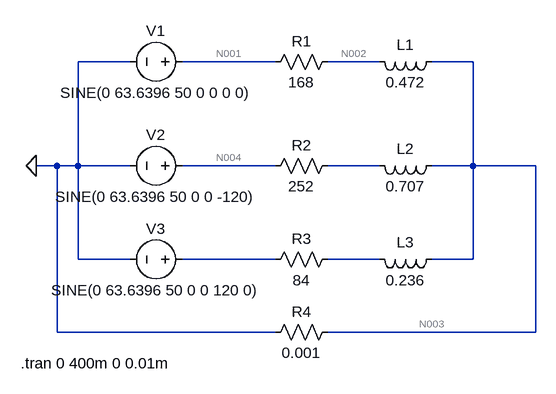
[diagram p0: schematic scheme3.asc]
scheme3.asc, the LTspice schematic file:
Version 4
SHEET 1 880 680
WIRE 128 112 48 112
WIRE 352 112 208 112
WIRE 512 112 432 112
WIRE 656 112 592 112
WIRE 16 272 -16 272
WIRE 48 272 48 112
WIRE 48 272 16 272
WIRE 128 272 48 272
WIRE 352 272 208 272
WIRE 512 272 432 272
WIRE 656 272 656 112
WIRE 656 272 592 272
WIRE 752 272 656 272
WIRE 48 416 48 272
WIRE 128 416 48 416
WIRE 352 416 208 416
WIRE 512 416 432 416
WIRE 656 416 656 272
WIRE 656 416 592 416
WIRE 16 528 16 272
WIRE 352 528 16 528
WIRE 752 528 752 272
WIRE 752 528 432 528
FLAG -16 272 0
SYMBOL voltage 224 112 R90
WINDOW 0 -32 56 VBottom 2
WINDOW 3 32 56 VTop 2
WINDOW 123 0 0 Left 0
WINDOW 39 0 0 Left 0
SYMATTR InstName V1
SYMATTR Value SINE(0 63.6396 50 0 0 0 0)
SYMBOL voltage 224 272 R90
WINDOW 0 -32 56 VBottom 2
WINDOW 3 32 56 VTop 2
WINDOW 123 0 0 Left 0
WINDOW 39 0 0 Left 0
SYMATTR InstName V2
SYMATTR Value SINE(0 63.6396 50 0 0 -120)
SYMBOL voltage 224 416 R90
WINDOW 0 -32 56 VBottom 2
WINDOW 3 32 56 VTop 2
WINDOW 123 0 0 Left 0
WINDOW 39 0 0 Left 0
SYMATTR InstName V3
SYMATTR Value SINE(0 63.6396 50 0 0 120 0)
SYMBOL res 448 96 R90
WINDOW 0 0 56 VBottom 2
WINDOW 3 32 56 VTop 2
SYMATTR InstName R1
SYMATTR Value 168
SYMBOL res 448 256 R90
WINDOW 0 0 56 VBottom 2
WINDOW 3 32 56 VTop 2
SYMATTR InstName R2
SYMATTR Value 252
SYMBOL res 448 400 R90
WINDOW 0 0 56 VBottom 2
WINDOW 3 32 56 VTop 2
SYMATTR InstName R3
SYMATTR Value 84
SYMBOL ind 608 96 R90
WINDOW 0 5 56 VBottom 2
WINDOW 3 32 56 VTop 2
SYMATTR InstName L1
SYMATTR Value 0.472
SYMBOL ind 608 256 R90
WINDOW 0 5 56 VBottom 2
WINDOW 3 32 56 VTop 2
SYMATTR InstName L2
SYMATTR Value 0.707
SYMBOL ind 608 400 R90
WINDOW 0 5 56 VBottom 2
WINDOW 3 32 56 VTop 2
SYMATTR InstName L3
SYMATTR Value 0.236
SYMBOL res 448 512 R90
WINDOW 0 0 56 VBottom 2
WINDOW 3 32 56 VTop 2
SYMATTR InstName R4
SYMATTR Value 0.001
TEXT -40 576 Left 2 !.tran 0 400m 0 0.01m

The netlist it stands for:
* scheme3.asc
V1 N001 0 SINE(0 63.6396 50 0 0 0 0)
V2 N004 0 SINE(0 63.6396 50 0 0 -120)
V3 N006 0 SINE(0 63.6396 50 0 0 120 0)
R1 N002 N001 168
R2 N005 N004 252
R3 N007 N006 84
L1 N003 N002 0.472
L2 N003 N005 0.707
L3 N003 N007 0.236
R4 N003 0 0.001
.tran 0 400m 0 0.01m
.backanno
.end

* Results of the author's LTspice run, read from the files saved beside the schematic
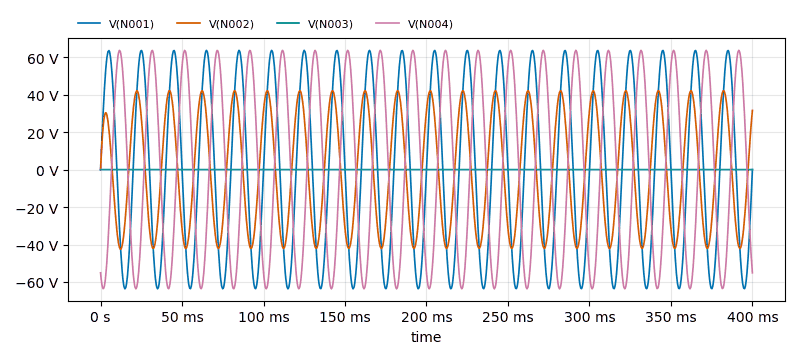
[diagram p1: Transient Analysis of scheme3.asc, plotted from the saved traces]
* Transient Analysis, 1 run:
*   V(N001): min -63.63 V, max 63.63 V, average -354.9 µV, rms 45 V, last 0 V
*   V(N002): min -42.47 V, max 42.11 V, average -222.1 mV, rms 29.6 V, last 31.57 V
*   V(N003): min -341 µV, max 437.4 µV, average 909.6 nV, rms 242.3 µV, last 308.3 µV
*   V(N004): min -63.64 V, max 63.64 V, average -46.58 µV, rms 45 V, last -55.11 V